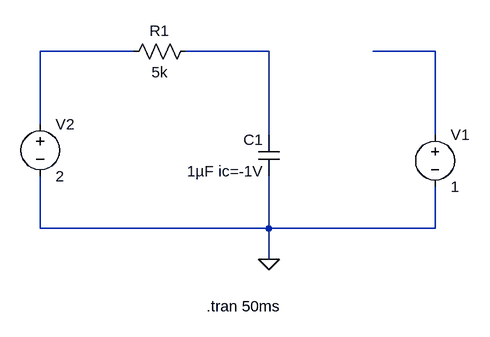
[diagram p0: schematic auf02.asc]
auf02.asc, the LTspice schematic file:
Version 4
SHEET 1 880 680
WIRE 144 128 0 128
WIRE 352 128 224 128
WIRE 608 128 512 128
WIRE 0 240 0 128
WIRE 352 256 352 128
WIRE 608 256 608 128
WIRE 0 400 0 320
WIRE 352 400 352 320
WIRE 352 400 0 400
WIRE 608 400 608 336
WIRE 608 400 352 400
WIRE 352 448 352 400
FLAG 352 448 0
SYMBOL voltage 608 240 R0
SYMATTR InstName V1
SYMATTR Value 1
SYMBOL voltage 0 224 R0
SYMATTR InstName V2
SYMATTR Value 2
SYMBOL Res 240 112 R90
WINDOW 0 0 56 VBottom 2
WINDOW 3 32 56 VTop 2
SYMATTR InstName R1
SYMATTR Value 5k
SYMBOL Cap 368 320 R180
WINDOW 0 24 56 Left 2
WINDOW 3 24 8 Left 2
SYMATTR InstName C1
SYMATTR Value 1µF ic=-1V
TEXT 256 520 Left 2 !.tran 50ms

The netlist it stands for:
* auf02.asc
V1 N003 0 1
V2 N001 0 2
R1 N002 N001 5k
C1 0 N002 1µF ic=-1V
.tran 50ms
.backanno
.end